# EAGLE design Eboard (EAGLE 8.4.0)
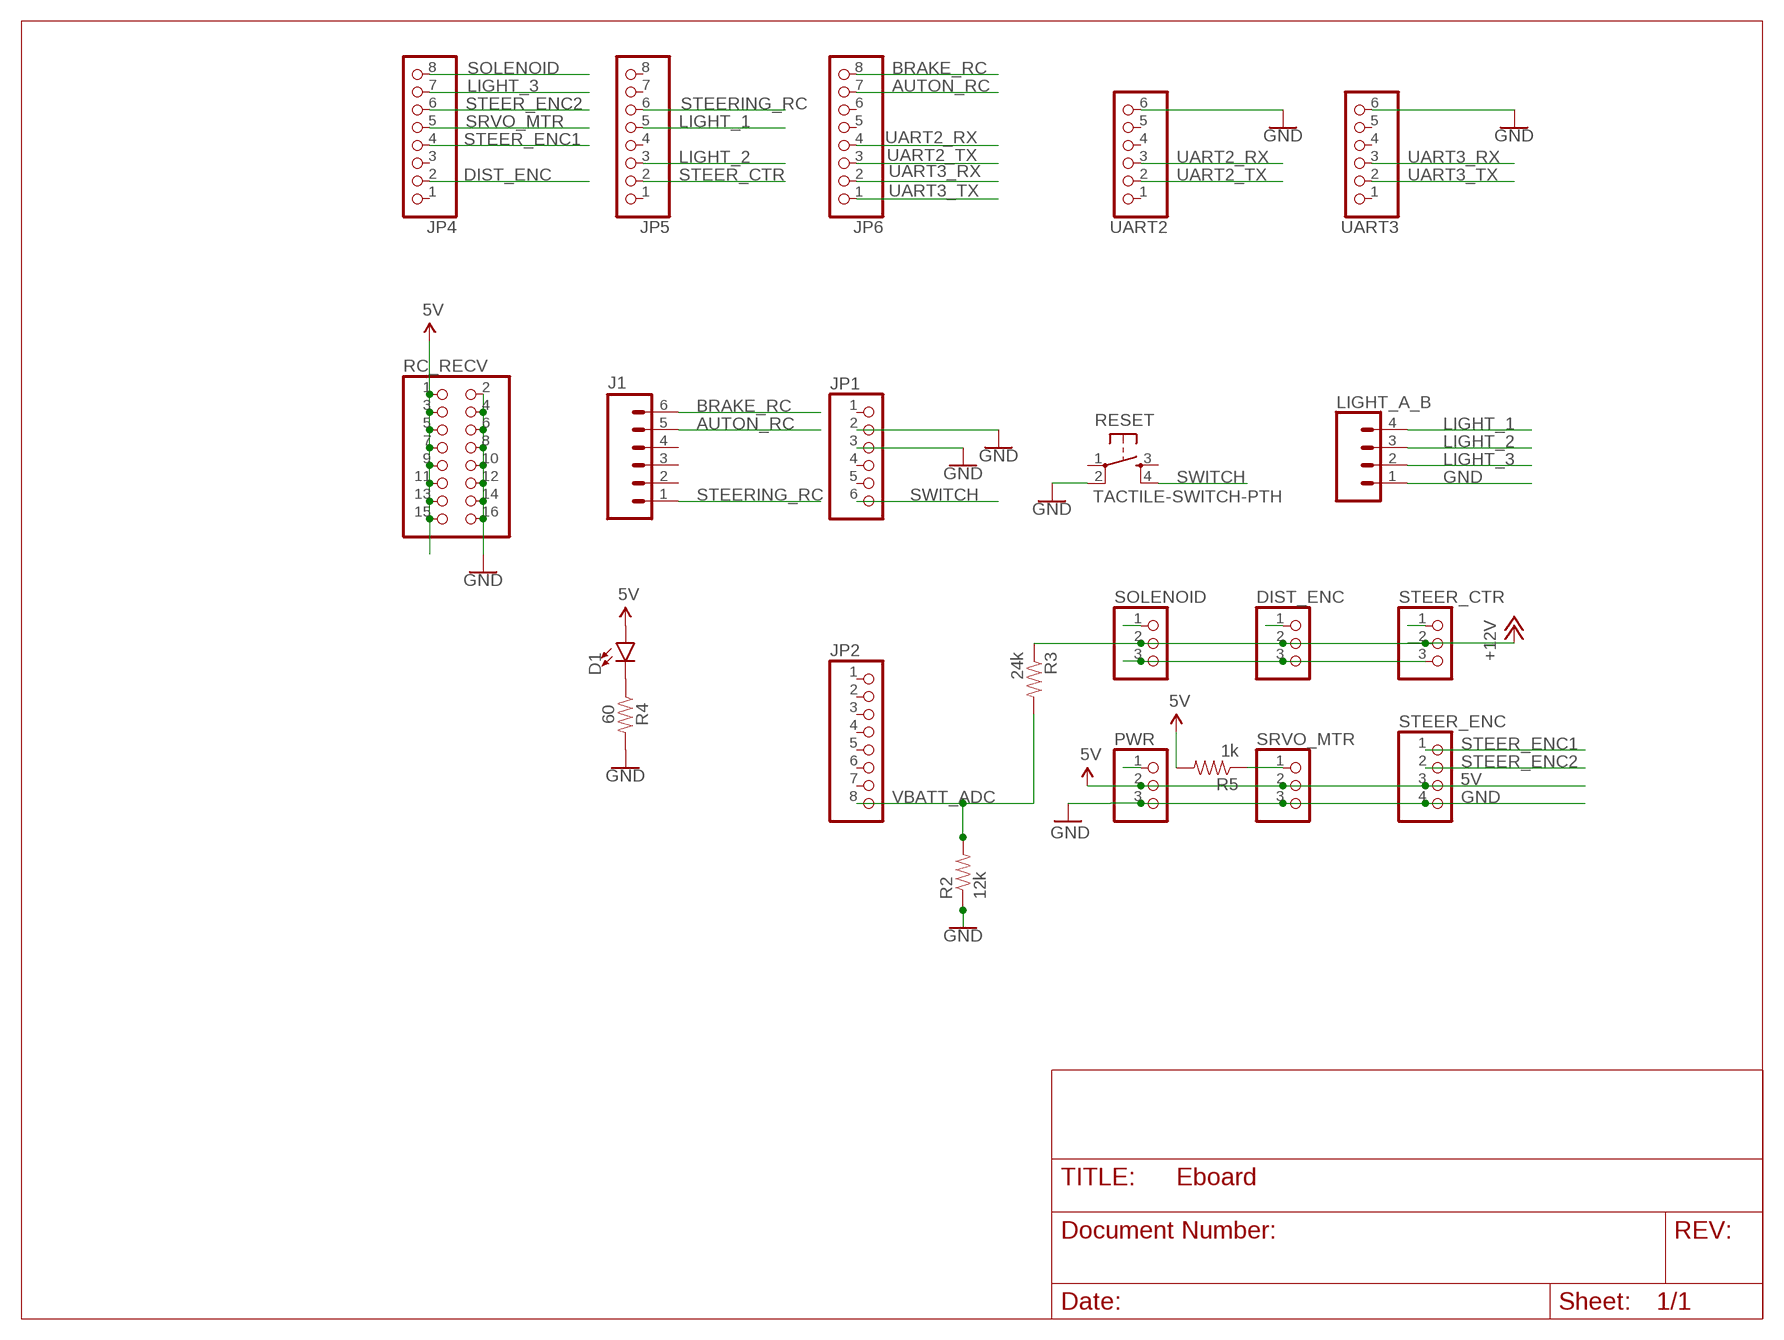
[diagram p0: schematic, sheet 1]

## Parts
D1  LED1206  [LED-1206]
DIST_ENC  PINHD-1X3  [1X03]
J1  M06SILK_FEMALE_PTH  [1X06]
JP1  PINHD-1X6  [1X06]
JP2  PINHD-1X8  [1X08]
JP4  PINHD-1X8  [1X08]
JP5  PINHD-1X8  [1X08]
JP6  PINHD-1X8  [1X08]
LIGHT_A_B  CONN_04  [1X04]
PWR  PINHD-1X3  [1X03]
R2  12k  1KOHM-1/4W-5%(PTH)  [AXIAL-0.3]
R3  24k  1KOHM-1/4W-5%(PTH)  [AXIAL-0.3]
R4  60  1KOHM-HORIZ-1/4W-5%  [AXIAL-0.3]
R5  1k  1KOHM-1/4W-5%(PTH)  [AXIAL-0.3]
RC_RECV  PINHD-2X8  [2X08]
RESET  TACTILE-SWITCH-PTH  [TAC-SWITCH-PTH]
SOLENOID  PINHD-1X3  [1X03]
SRVO_MTR  PINHD-1X3  [1X03]
STEER_CTR  PINHD-1X3  [1X03]
STEER_ENC  PINHD-1X4  [1X04]
UART2  PINHD-1X6  [1X06]
UART3  PINHD-1X6  [1X06]

## Nets
5V: D1.A PWR.2 R5.P$2 RC_RECV.1 RC_RECV.3 RC_RECV.5 RC_RECV.7 RC_RECV.9 RC_RECV.11 RC_RECV.13 RC_RECV.15 SRVO_MTR.2 STEER_ENC.3
12V: DIST_ENC.2 PWR.1 R3.P$1 SOLENOID.2 STEER_CTR.2 ; supply symbol labelled +12V
AUTON_RC: J1.5 JP6.7
BRAKE_RC: J1.6 JP6.8
DIST_ENC: DIST_ENC.1 JP4.2
GND: DIST_ENC.3 JP1.2 JP1.3 LIGHT_A_B.1 PWR.3 R2.P$1 R4.P$2 RC_RECV.2 RC_RECV.4 RC_RECV.6 RC_RECV.8 RC_RECV.10 RC_RECV.12 RC_RECV.14 RC_RECV.16 RESET.2 SOLENOID.3 SRVO_MTR.3 STEER_CTR.3 STEER_ENC.4 UART2.6 UART3.6
LIGHT_1: JP5.5 LIGHT_A_B.4
LIGHT_2: JP5.3 LIGHT_A_B.3
LIGHT_3: JP4.7 LIGHT_A_B.2
N$1: D1.C R4.P$1
SOLENOID: JP4.8 SOLENOID.1
SRVO_MTR: JP4.5 R5.P$1 SRVO_MTR.1
STEER_CTR: JP5.2 STEER_CTR.1
STEER_ENC1: JP4.4 STEER_ENC.1
STEER_ENC2: JP4.6 STEER_ENC.2
STEERING_RC: J1.1 JP5.6
SWITCH: JP1.6 RESET.4
UART2_RX: JP6.4 UART2.3
UART2_TX: JP6.3 UART2.2
UART3_RX: JP6.2 UART3.3
UART3_TX: JP6.1 UART3.2
VBATT_ADC: JP2.8 R2.P$2 R3.P$2
Unconnected: J1.2 J1.3 J1.4 JP1.1 JP1.4 JP1.5 JP2.1 JP2.2 JP2.3 JP2.4 JP2.5 JP2.6 JP2.7 JP4.1 JP4.3 JP5.1 JP5.4 JP5.7 JP5.8 JP6.5 JP6.6 RESET.1 RESET.3 UART2.1 UART2.4 UART2.5 UART3.1 UART3.4 UART3.5

## Library data of the parts
D1 = SparkFun-LED:LED: LED (Generic) Standard schematic elements and footprints for 5mm, 3mm, 1206, and 0603 sized LEDs. Generic LEDs with no color specified.
DIST_ENC PWR SOLENOID SRVO_MTR STEER_CTR = pinhead:PINHD-1X3: PIN HEADER
J1 = SparkFun-Connectors:M06: Header 6 Standard 6-pin 0.1" header. Use with straight break away headers (SKU : PRT-00116), right angle break away headers (PRT-00553), swiss pins (PRT-00743), machine pins (PRT-00117), and female headers (PRT-00115). Molex polarized connector foot print use with SKU : PRT-08094 with associated crimp pins and housings. NOTES ON THE VARIANTS LOCK and LOCK_LONGPADS... This footprint was designed to help hold the alignment of a through-hole component (i.e. 6-pin header) while soldering it into place. You may notice that each hole has been shifted either up or down by 0.005 of an inch from it's more standard position (which is a perfectly straight line). This slight alteration caused the pins (the squares in the middle) to touch the edges of the holes. Because they are alternating, it causes a "brace" to hold the component in place. 0.005 has proven to be the perfect amount of "off-center" position when using our standard breakaway headers. Although looks a little odd when you look at the bare footprint, once you have a header in there, the alteration is very hard to notice. Also,if you push a header all the way into place, it is covered up entirely on the bottom side. This idea of altering the position of holes to aid alignment will be further integrated into the Sparkfun Library for other footprints. It can help hold any component with 3 or more connection pins.; PROD_ID: CONN-08437
JP1 UART2 UART3 = pinhead:PINHD-1X6: PIN HEADER
JP2 JP4-JP6 = pinhead:PINHD-1X8: PIN HEADER
LIGHT_A_B = SparkFun-Connectors:CONN_04: Multi connection point. Often used as Generic Header-pin footprint for 0.1 inch spaced/style header connections On any of the 0.1 inch spaced packages, you can populate with these: Break Away Headers - Straight <https://www.sparkfun.com/products/116> (PRT-00116) Break Away Male Headers - Right Angle <https://www.sparkfun.com/products/553> (PRT-00553) Female Headers <https://www.sparkfun.com/products/115> (PRT-00115) Break Away Headers - Machine Pin <https://www.sparkfun.com/products/117> (PRT-00117) Break Away Female Headers - Swiss Machine Pin <https://www.sparkfun.com/products/743> (PRT-00743) For SCREWTERMINALS and SPRING TERMINALS visit here: Screw Terimnals on SparkFun.com <https://www.sparkfun.com/search/results?term=Screw+Terminals> (5mm/3.5mm/2.54mm spacing) This device is also useful as a general connection point to wire up your design to another part of your project. Our various solder wires solder well into these plated through hole pads. Hook-Up Wire - Assortment (Stranded, 22 AWG) <https://www.sparkfun.com/products/11375> (PRT-11375) Hook-Up Wire - Assortment (Solid Core, 22 AWG) <https://www.sparkfun.com/products/11367> (PRT-11367) View the entire wire category on our website here <https://www.sparkfun.com/categories/141> Special notes: Molex polarized connector foot print use with SKU : PRT-08231 with associated crimp pins and housings. 1MM SMD Version SKU: PRT-10208; PROD_ID: CONN-09696
R2 R3 = SparkFun-Resistors:1KOHM-1/4W-5%(PTH): RES-08380; PROD_ID: RES-08380; VALUE: 1k
R4 = SparkFun-Resistors:1KOHM: 1kΩ resistor A resistor is a passive two-terminal electrical component that implements electrical resistance as a circuit element. Resistors act to reduce current flow, and, at the same time, act to lower voltage levels within circuits. - Wikipedia; PROD_ID: RES-08380; VALUE: 1k
R5 = SparkFun-Resistors:1KOHM-1/4W-5%(PTH): RES-08380; PROD_ID: RES-08380
RC_RECV = pinhead:PINHD-2X8: PIN HEADER
RESET = GeekAmmo:TACTILE-SWITCH: Tactile Switch 4 Pins, SPST NO
STEER_ENC = pinhead:PINHD-1X4: PIN HEADER

## Board
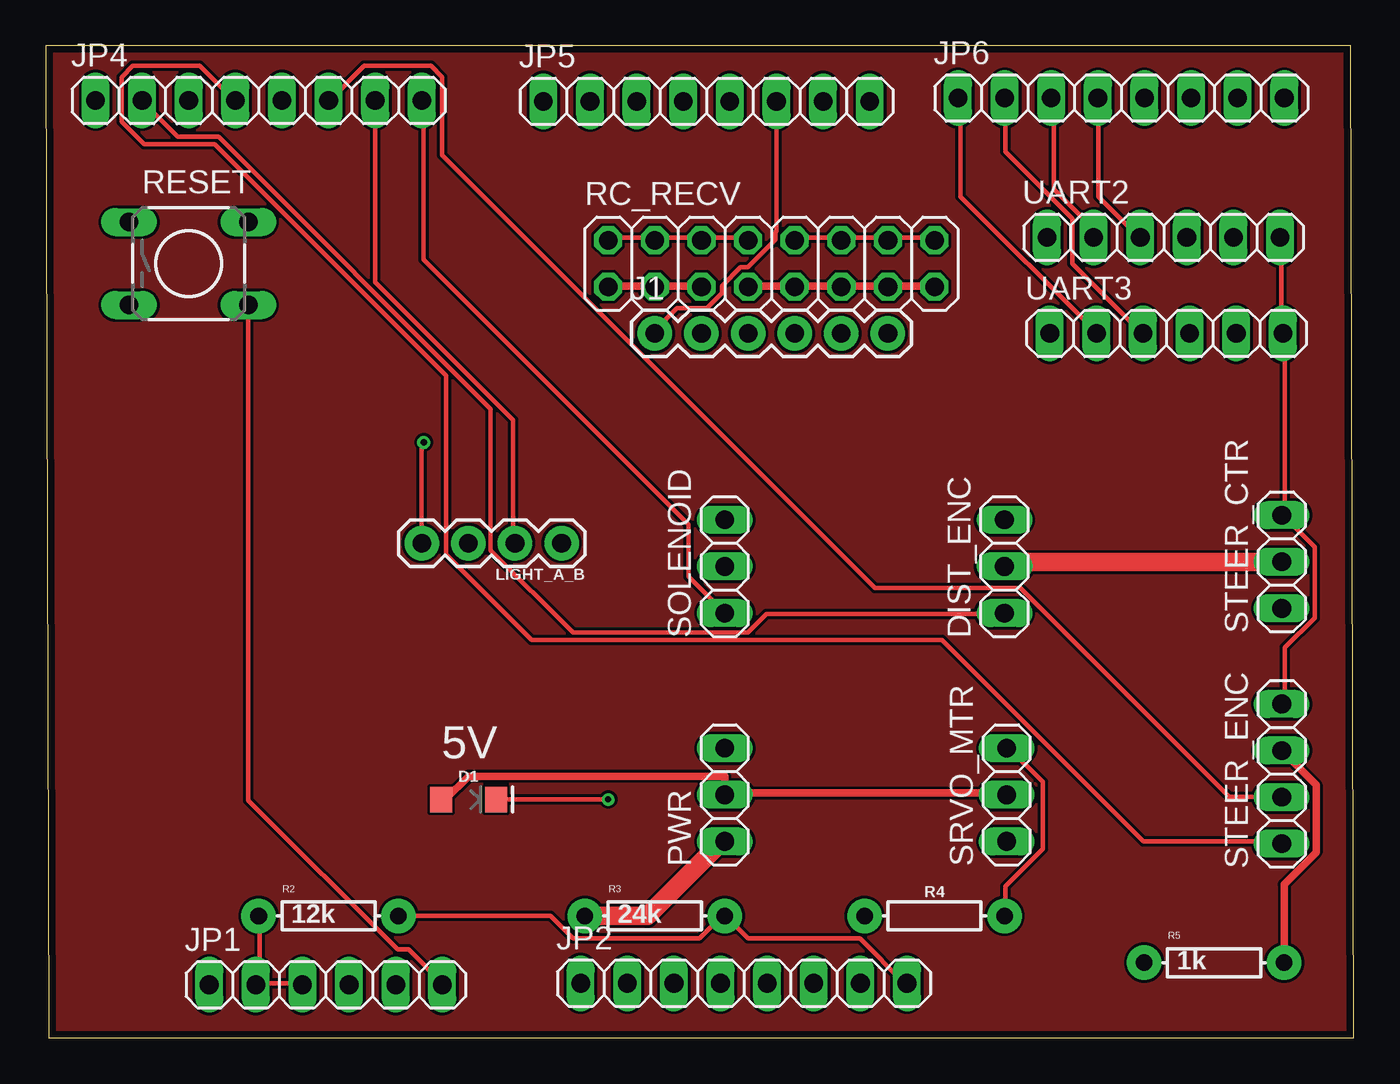
[diagram p1: board, top side]
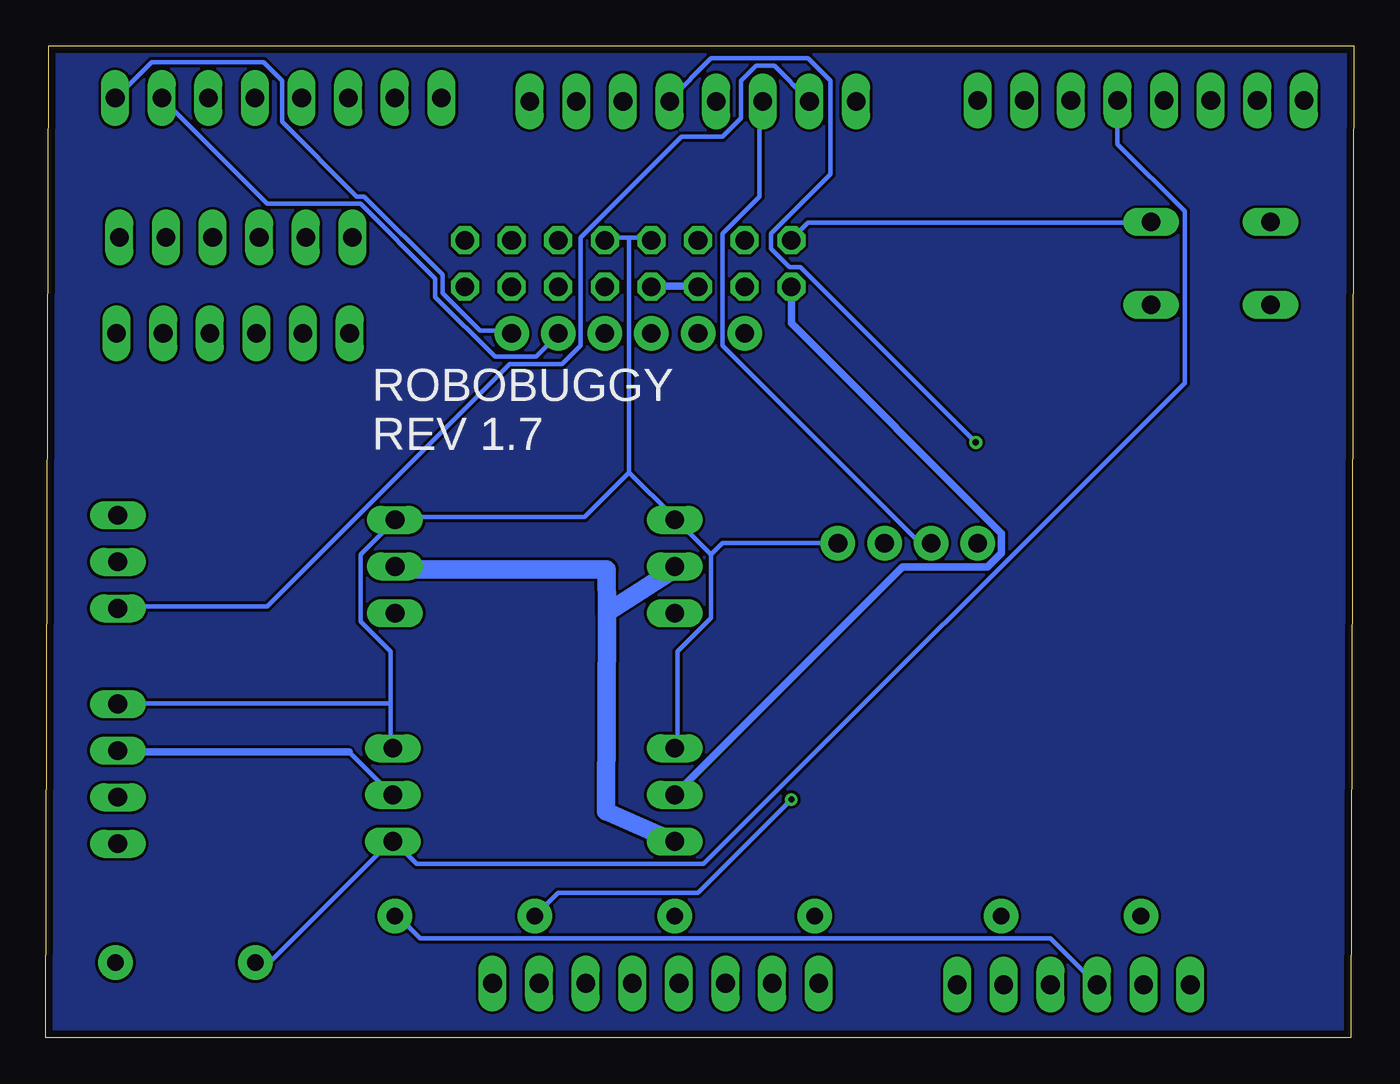
[diagram p2: board, bottom side, seen from below]

Size 71.27 x 54.05 mm. Coordinates in mm from the lower left corner, seen from the top.
Outline: 0.17,0 71.27,0 71.1,54.05 0,54.05 0.17,0
Copper layers (1*16): Top 0.0356mm / dielectric 1.5011mm / Bottom 0.0356mm
Design rules "oshpark-2layer": minimum track width 6mil, minimum drill 13mil, track to track 6mil, track to pad 6mil, pad to pad 6mil, via to via 6mil, smd to smd 6mil, copper to edge 15mil, drill to drill 6mil, minimum pad ring 7mil, minimum via ring 7mil, stop-mask expansion 2.5mil, vias tented up to drill 0mil, thermal gap 10mil

### Footprints (pad centres in the part's own frame; a part is rotated, then mirrored left to right if it is on the bottom)
LED-1206 = smd 1.2 x 1.4: A -1.5,0; C 1.5,0
1X03 = drill 1.016 long: 1 -2.54,0; 2 0,0; 3 2.54,0
1X06 = drill 1.016 pad 1.88: 1 0,0; 2 2.54,0; 3 5.08,0; 4 7.62,0; 5 10.16,0; 6 12.7,0
1X06' = drill 1.016 long: 1 -6.35,0; 2 -3.81,0; 3 -1.27,0; 4 1.27,0; 5 3.81,0; 6 6.35,0
1X08 = drill 1.016 long: 1 -8.89,0; 2 -6.35,0; 3 -3.81,0; 4 -1.27,0; 5 1.27,0; 6 3.81,0; 7 6.35,0; 8 8.89,0
1X04 = drill 1.016 pad 1.88: 1 0,0; 2 2.54,0; 3 5.08,0; 4 7.62,0
AXIAL-0.3 = drill 0.9 pad 1.88: P$1 -3.81,0; P$2 3.81,0
2X08 = drill 1.016 octagon: 1 -8.89,-1.27; 2 -8.89,1.27; 3 -6.35,-1.27; 4 -6.35,1.27; 5 -3.81,-1.27; 6 -3.81,1.27; 7 -1.27,-1.27; 8 -1.27,1.27; 9 1.27,-1.27; 10 1.27,1.27; 11 3.81,-1.27; 12 3.81,1.27; 13 6.35,-1.27; 14 6.35,1.27; 15 8.89,-1.27; 16 8.89,1.27
TAC-SWITCH-PTH = drill 1.016 pad 1.524 long: 1 -3.251,2.261; 2 3.251,2.261; 3 -3.251,-2.261; 4 3.251,-2.261
1X04' = drill 1.016 long: 1 -3.81,0; 2 -1.27,0; 3 1.27,0; 4 3.81,0

### Placement (x,y rotation side)
D1  23.03,12.98 0 top
DIST_ENC  52.24,25.68 90 top
J1  33.19,38.38 0 top
JP1  [1X06']  15.25,2.88 0 top
JP2  38.04,2.96 0 top
JP4  11.6,51.08 0 top
JP5  36,51.03 0 top
JP6  58.6,51.21 0 top
LIGHT_A_B  28.11,26.95 180 top
PWR  37,13.23 90 top
R2  15.41,6.63 0 top
R3  33.19,6.63 0 top
R4  48.43,6.63 0 top
R5  63.67,4.09 0 top
RC_RECV  39.54,42.19 0 top
RESET  7.79,42.19 0 top
SOLENOID  37,25.68 90 top
SRVO_MTR  52.36,13.23 90 top
STEER_CTR  67.35,25.93 90 top
STEER_ENC  [1X04']  67.35,14.38 90 top
UART2  [1X06']  60.91,43.61 0 top
UART3  [1X06']  61.06,38.38 0 top

### Tracks (layer width: path | path; a pad name or v marks a point on that pad's centre or on a via)
5V
  Top 0.254: PWR.2 37.05,13.33 | 40.91,40.97 RC_RECV.9 | 30.75,40.97 RC_RECV.1 | 33.19,40.97 RC_RECV.3 | 45.78,40.97 RC_RECV.13 | 21.76,12.98 D1.A
  Top 0.406: 37.05,13.33 52.29,13.33 SRVO_MTR.2 | RC_RECV.13 45.99,40.97 48.43,40.97 RC_RECV.15 | 43.35,40.97 40.91,40.97 | 30.75,40.97 33.19,40.97 35.62,40.97 RC_RECV.5 | RC_RECV.9 40.7,40.97 38.27,40.97 RC_RECV.7 | 43.35,40.97 45.78,40.97 | 43.35,40.97 RC_RECV.11 | 21.76,12.98 23.03,14.25 37,14.25 PWR.2 | R5.P$2 67.48,8.35 69.23,10.1 69.23,13.77 STEER_ENC.3
  Bottom 0.254: 35.83,40.97 RC_RECV.5 | 38.27,40.97 RC_RECV.7 | 54.75,15.57 52.51,13.33 SRVO_MTR.2 | 67.35,15.57 STEER_ENC.3
  Bottom 0.406: 38.27,40.97 35.83,40.97 | 30.54,40.77 RC_RECV.1 30.65,38.94 19.19,27.49 19.19,26.41 19.95,25.65 24.57,25.65 PWR.2 | 54.75,15.57 67.35,15.57
12V
  Top 0.254: 36.84,10.69 PWR.1
  Top 1.016: STEER_CTR.2 52.49,25.93 DIST_ENC.2 | R3.P$1 32.78,6.63 36.84,10.69
  Bottom 0.254: 37.05,10.69 PWR.1 | 37.05,25.53 SOLENOID.2
  Bottom 1.016: 37.05,10.69 40.73,12.32 40.69,23.16 | 37.05,25.53 40.69,23.16 | 40.69,23.16 40.7,25.53 52.08,25.53 DIST_ENC.2
AUTON_RC
  Bottom 0.254: JP6.7 64.88,51.13 59.19,45.44 54.11,45.44 50.05,41.38 50.05,40.36 46.8,37.11 44.56,37.11 43.35,38.33 J1.5
BRAKE_RC
  Bottom 0.254: J1.6 45.99,38.53 47.61,38.53 49.64,40.56 49.64,41.58 53.91,45.85 54.32,45.85 58.38,49.91 58.38,52.15 59.4,53.16 65.49,53.16 67.45,51.21 JP6.8
DIST_ENC
  Top 0.254: DIST_ENC.1 52.08,23.09 39.28,23.09 38.27,22.07 28.71,22.07 24.24,26.54 24.24,34.26 9.41,49.1 7.18,49.1 5.35,50.93 JP4.2
GND
  Top 0.254: 11.65,2.97 13.88,2.97 JP1.3 | 11.65,2.97 11.44,2.97 JP1.2 11.65,2.97 | UART2.6 67.32,43.61 67.32,38.53 UART3.6 67.53,38.33 67.53,28.57 STEER_CTR.3 67.53,28.37 69.15,26.75 69.15,22.89 67.53,21.26 67.53,18.21 STEER_ENC.4 | RC_RECV.16 48.43,43.61 45.99,43.61 RC_RECV.14 45.78,43.61 43.35,43.61 | 43.35,43.61 40.91,43.61 RC_RECV.10 | 33.19,43.61 30.75,43.61 RC_RECV.2 | RC_RECV.8 38.27,43.61 35.83,43.61 RC_RECV.6 35.62,43.61 33.19,43.61 | 33.19,43.61 RC_RECV.4 | 43.35,43.61 RC_RECV.12 | 11.65,2.97 11.65,6.63 R2.P$1 | R4.P$2 52.29,6.63 52.29,8.25 54.32,10.29 54.32,13.94 52.49,15.77 SRVO_MTR.3
  Bottom 0.254: 52.49,18.21 52.49,21.06 54.11,22.68 54.11,26.34 DIST_ENC.3 52.08,28.37 41.92,28.37 39.48,30.81 | 52.49,18.21 52.49,15.77 SRVO_MTR.3 | 52.49,18.21 67.32,18.21 STEER_ENC.4 | 39.48,43.61 38.27,43.61 RC_RECV.8 | 39.48,43.61 40.7,43.61 RC_RECV.10 | 35.01,26.34 35.01,22.89 36.84,21.06 36.84,15.77 PWR.3 | 35.01,26.34 36.84,28.17 SOLENOID.3 37.05,28.37 39.48,30.81 | LIGHT_A_B.1 34.4,26.95 35.01,26.34 | 39.48,30.81 39.48,43.61 | RC_RECV.2 30.54,43.61 29.73,44.42 11.06,44.42 RESET.2 | JP1.3 14.08,2.97 16.52,5.41 50.86,5.41 52.08,6.63 R4.P$2
LIGHT_1  (via drill 0.35)
  Top 0.254: LIGHT_A_B.4 20.49,32.33 v20.59,32.44
  Bottom 0.254: v20.59,32.44 30.14,41.99 30.75,41.99 31.76,43 31.76,43.81 28.51,47.07 28.51,52.15 29.73,53.37 35.01,53.37 37.25,51.13 JP5.5
LIGHT_2
  Bottom 0.254: JP5.3 32.37,50.93 32.37,45.85 34.4,43.81 34.4,37.72 23.63,26.95 LIGHT_A_B.3
LIGHT_3
  Top 0.254: JP4.7 17.95,41.17 25.46,33.65 25.46,26.95 LIGHT_A_B.2
N$1  (via drill 0.33)
  Top 0.254: v30.65,12.98 D1.C
  Bottom 0.254: v30.65,12.98 35.73,7.9 43.35,7.9 R4.P$1
N$2
  pour Bottom: -0.01,54.28 -0.01,0.14 0.11,0.01 0.2,-0.08 71.26,-0.08 71.26,54.23 71.21,54.28
N$3
  pour Top: -0.01,54.28 0.03,54.24 0.03,-0.08 71.36,-0.08 71.36,54.03 71.11,54.28
SOLENOID
  Top 0.254: SOLENOID.1 35.01,25.12 35.01,27.97 20.59,42.39 20.59,50.93 JP4.8
SRVO_MTR
  Bottom 0.254: JP4.5 12.87,48.69 9.21,45.03 9.21,35.69 35.42,9.47 51.07,9.47 52.29,10.69 SRVO_MTR.1 52.49,10.69 58.99,4.19 59.8,4.19 R5.P$1
STEER_CTR
  Bottom 0.254: STEER_CTR.1 67.32,23.49 59.19,23.49 45.99,36.7 43.14,36.7 42.13,37.72 42.13,43.61 36.64,49.1 34.4,49.1 33.39,50.11 33.39,52.15 32.58,52.96 31.56,52.96 29.73,51.13 JP5.2
STEER_ENC1
  Top 0.254: STEER_ENC.1 67.32,10.69 59.8,10.69 48.83,21.67 26.48,21.67 21.81,26.34 21.81,36.09 9.21,48.69 5.35,48.69 4.13,49.91 4.13,52.35 4.74,52.96 8.39,52.96 10.22,51.13 JP4.4
STEER_ENC2
  Top 0.254: STEER_ENC.2 67.32,13.13 64.48,13.13 53.1,24.51 45.17,24.51 21.6,48.08 21.6,52.35 20.99,52.96 17.34,52.96 15.51,51.13 JP4.6
STEERING_RC
  Top 0.254: J1.1 33.19,38.53 34.4,39.75 36.03,39.75 36.84,40.56 36.84,40.97 37.86,41.99 38.27,41.99 39.76,43.48 39.76,43.89 39.81,43.94 JP5.6
SWITCH
  Top 0.254: RESET.4 11.04,12.93 19.16,4.8 19.77,4.8 21.6,2.97 JP1.6
UART2_RX
  Top 0.254: JP6.4 57.37,51.13 57.37,45.85 59.6,43.61 UART2.3
UART2_TX
  Top 0.254: JP6.3 54.93,51.13 54.93,46.25 56.96,44.22 56.96,43.61 UART2.2
UART3_RX
  Top 0.254: JP6.2 52.29,51.13 52.29,48.29 55.94,44.63 55.94,42.19 59.6,38.53 UART3.3
UART3_TX
  Top 0.254: JP6.1 49.85,51.13 49.85,45.85 57.16,38.53 UART3.2
VBATT_ADC
  Top 0.254: JP2.8 46.8,2.97 44.36,5.41 38.27,5.41 37.05,6.63 R3.P$2 36.84,6.63 35.62,5.41 28.71,5.41 27.5,6.63 R2.P$2

### Text on the board
tNames: 5V
bNames: ROBOBUGGY / REV 1.7